# Altium schematic sheet devBoard.SchDoc: STM32 DevKit
size A3; Author: Mehran Ahmadi; DrawnBy: Mehran Ahmadi; DocumentNumber: 1; Revision: 1; SheetNumber: 1; SheetTotal: 1
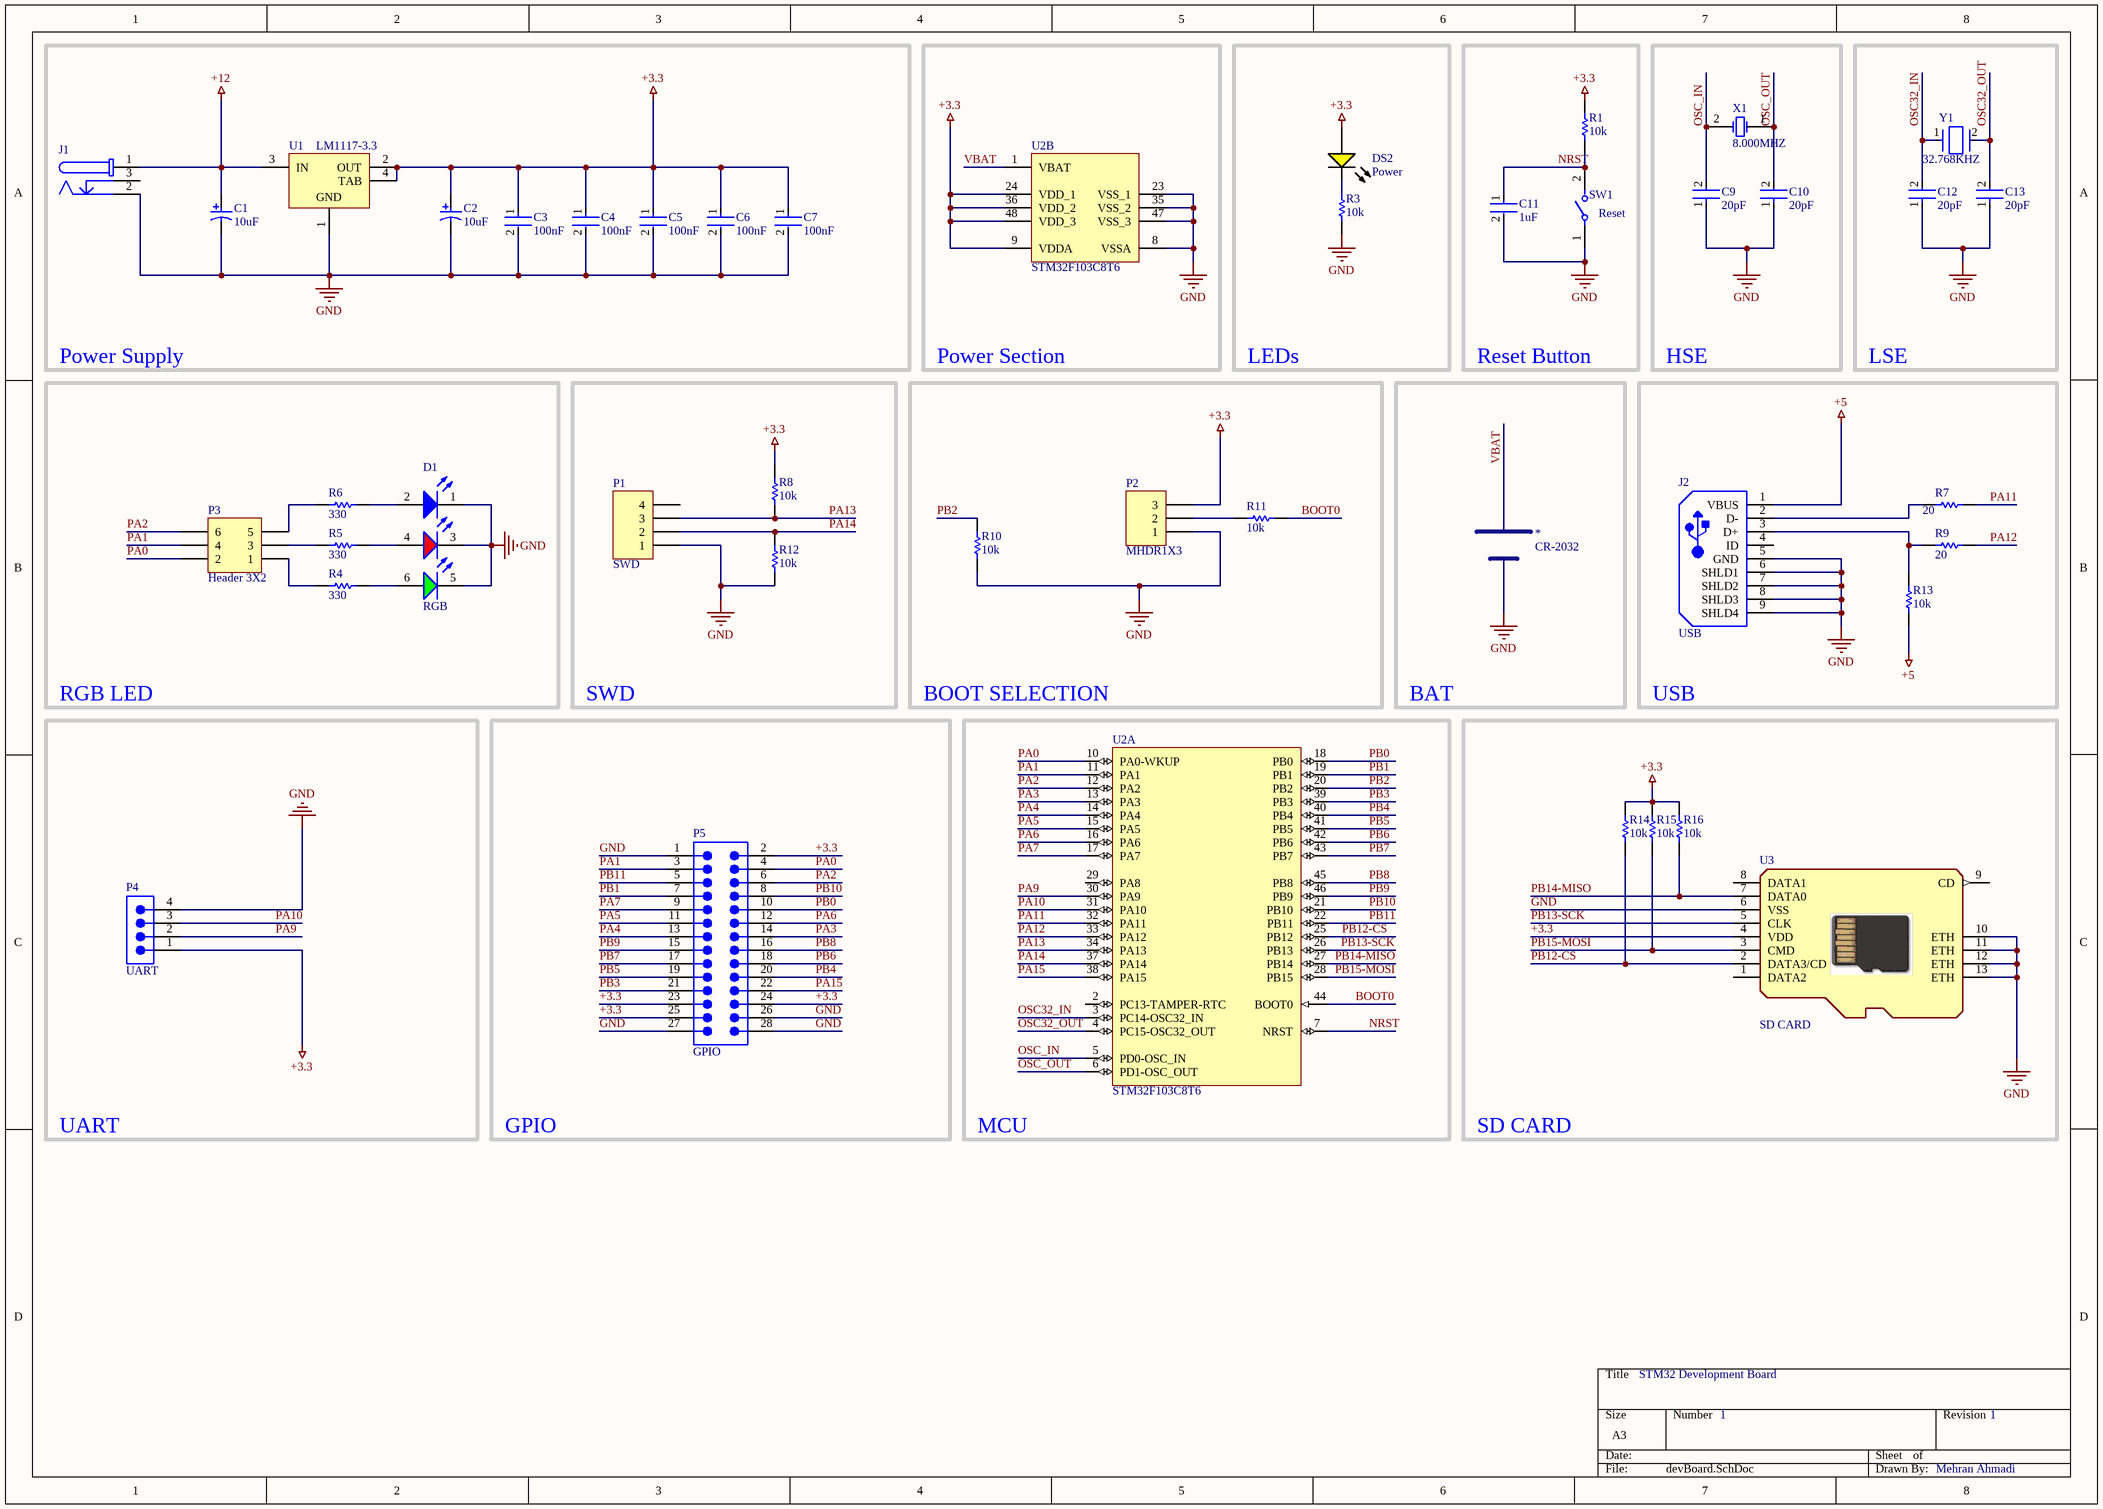
[diagram p0: devBoard.SchDoc]

## Parts
*  CR-2032  [CR-2032]
C1  10uF  [PNSC-EEE1CA100SR_L]
C2  10uF  [PNSC-EEE1CA100SR_L]
C3  100nF  [FP-1206-L_3_2_0_2-W_1_6_0-MFG]
C4  100nF  [FP-1206-L_3_2_0_2-W_1_6_0-MFG]
C5  100nF  [FP-1206-L_3_2_0_2-W_1_6_0-MFG]
C6  100nF  [FP-1206-L_3_2_0_2-W_1_6_0-MFG]
C7  100nF  [FP-1206-L_3_2_0_2-W_1_6_0-MFG]
C9  20pF  [FP-CL31-IPC_A]
C10  20pF  [FP-CL31-IPC_A]
C11  1uF  [FP-1206-L_3_2_0_2-W_1_6_0-MFG]
C12  20pF  [FP-CL31-IPC_A]
C13  20pF  [FP-CL31-IPC_A]
D1  RGB  [WL-SFTW_5050_150505M173300]
DS2  Power  [LUMX-SML-LX1206YC-TR_V]
J1  (no value)  [694106301002]
J2  USB  [MOLX-56579-0576_V]
P1  SWD  [HDR1X4]
P2  MHDR1X3  [MHDR1X3]
P3  Header 3X2  [HDR2X3]
P4  UART  [61300411121]
P5  GPIO  [61302821121]
R1  10k  [RESC3116X65X40ML10T20]
R3  10k  [RESC3116X65X40ML10T20]
R4  330  [RESC3116X65X40ML10T20]
R5  330  [RESC3116X65X40ML10T20]
R6  330  [RESC3116X65X40ML10T20]
R7  20  [RESC3116X65X40ML10T20]
R8  10k  [RESC3116X65X40ML10T20]
R9  20  [RESC3116X65X40ML10T20]
R10  10k  [RESC3116X65X40ML10T20]
R11  10k  [RESC3116X65X40ML10T20]
R12  10k  [RESC3116X65X40ML10T20]
R13  10k  [RESC3116X65X40ML10T20]
R14  10k  [RESC3116X65X40ML10T20]
R15  10k  [RESC3116X65X40ML10T20]
R16  10k  [RESC3116X65X40ML10T20]
SW1  Reset  [FP-1825965-1-MFG]
U1  LM1117-3.3  [DCY0004A_N]
U2  STM32F103C8T6  [STM-LQFP48_L]  (parts A,B of 2)
U3  SD CARD  [TFWF1-EBXX-1X0X]
X1  8.000MHZ  [ABRA-ABLS-14.7456MHZ-B2-T_V]
Y1  32.768KHZ  [FP-AB26TRB-MFG]

## Blocks framed on the sheet
Power Supply: C1-C7 J1 U1
Power Section: U2
LEDs: DS2 R3
Reset Button: C11 R1 SW1
HSE: C9 C10 X1
LSE: C12 C13 Y1
SWD: P1 R8 R12
BOOT SELECTION: P2 R10 R11
BAT: *
USB: J2 R7 R9 R13
GPIO: P5
MCU: U2
SD CARD: R14-R16 U3

## Nets
+3.3: C2.1 C3.1 C4.1 C5.1 C6.1 C7.1 DS2.1(A) P2.3 P4.1 P5.2 P5.23 P5.24 P5.25 R1.2 R8.2 R14.1 R15.1 R16.1 U1.2(OUT) U1.4(TAB) U2.9(VDDA) U2.24(VDD_1) U2.36(VDD_2) U2.48(VDD_3) U3.4(VDD)
+5: J2.1(VBUS) R13.2
+12: C1.1 J1.1 U1.3(IN)
GND: *.2 C1.2 C2.2 C3.2 C4.2 C5.2 C6.2 C7.2 C9.1 C10.1 C11.2 C12.1 C13.1 D1.1(K) D1.3(K) D1.5(K) J1.2 J2.5(GND) J2.6(SHLD1) J2.7(SHLD2) J2.8(SHLD3) J2.9(SHLD4) P1.1 P2.1 P4.4 P5.1 P5.26 P5.27 P5.28 R3.1 R10.2 R12.1 SW1.1 U1.1(GND) U2.8(VSSA) U2.23(VSS_1) U2.35(VSS_2) U2.47(VSS_3) U3.6(VSS) U3.10(ETH) U3.11(ETH) U3.12(ETH) U3.13(ETH)
BOOT0: R11.1 U2.44(BOOT0)
NRST: C11.1 R1.1 SW1.2 U2.7(NRST)
OSC32_IN: C12.2 U2.3(PC14-OSC32_IN) Y1.1
OSC32_OUT: C13.2 U2.4(PC15-OSC32_OUT) Y1.2
OSC_IN: C9.2 U2.5(PD0-OSC_IN) X1.2(X2)
OSC_OUT: C10.2 U2.6(PD1-OSC_OUT) X1.1(X1)
PA0: P3.2 P5.4 U2.10(PA0-WKUP)
PA1: P3.4 P5.3 U2.11(PA1)
PA2: P3.6 P5.6 U2.12(PA2)
PA3: P5.14 U2.13(PA3)
PA4: P5.13 U2.14(PA4)
PA5: P5.11 U2.15(PA5)
PA6: P5.12 U2.16(PA6)
PA7: P5.9 U2.17(PA7)
PA9: P4.2 U2.30(PA9)
PA10: P4.3 U2.31(PA10)
PA11: R7.2 U2.32(PA11)
PA12: R9.2 U2.33(PA12)
PA13: P1.3 R8.1 U2.34(PA13)
PA14: P1.2 R12.2 U2.37(PA14)
PA15: P5.22 U2.38(PA15)
PB0: P5.10 U2.18(PB0)
PB1: P5.7 U2.19(PB1)
PB2: R10.1 U2.20(PB2)
PB3: P5.21 U2.39(PB3)
PB4: P5.20 U2.40(PB4)
PB5: P5.19 U2.41(PB5)
PB6: P5.18 U2.42(PB6)
PB7: P5.17 U2.43(PB7)
PB8: P5.16 U2.45(PB8)
PB9: P5.15 U2.46(PB9)
PB10: P5.8 U2.21(PB10)
PB11: P5.5 U2.22(PB11)
PB12-CS: R14.2 U2.25(PB12) U3.2(DATA3/CD)
PB13-SCK: U2.26(PB13) U3.5(CLK)
PB14-MISO: R16.2 U2.27(PB14) U3.7(DATA0)
PB15-MOSI: R15.2 U2.28(PB15) U3.3(CMD)
VBAT: *.1 U2.1(VBAT)
NetD1_2: D1.2(A) R6.1
NetD1_4: D1.4(A) R5.1
NetD1_6: D1.6(A) R4.1
NetDS2_2: DS2.2(K) R3.2
NetJ2_2: J2.2(D-) R7.1
NetJ2_3: J2.3(D+) R9.1 R13.1
NetP2_2: P2.2 R11.2
NetP3_1: P3.1 R4.2
NetP3_3: P3.3 R5.2
NetP3_5: P3.5 R6.2

Not connected (* = marked no-connect by the designer): J1 3; J2 4(ID); P1 4; U2 2(PC13-TAMPER-RTC) 29(PA8); U3 1(DATA2) 8(DATA1) 9(CD)

## Notes on the sheet
- RGB LED
- UART
- STM32 Development Board
- 1
- Mehran Ahmadi
- (in symbol TFWF1-EBXX-1X0X) Card Bottom View

## Library data of the parts
C1 C2 = CMP-2000-06199-1: Aluminum Electrolytic Capacitor, 10 uF, +/- 20%, -40 to 85 degC, 2-Pin SMD, RoHS, Tape and Reel; Manufacturer: Panasonic; Lead Length: 1.8mm; No. of Pins: 2; Ripple Current Frequency: 120Hz; Ripple Current Temperature: 85°C; External Depth: 4.3mm; Operating Lifetime: 2000h; Power Factor: 0.16; Lead Cross-section Width: 0.65mm; Product Range: PANASONIC-SSeries; Voltage Rating V DC: 16V; Leakage Current: 3µA; Ripple Current AC: 28mA; AE Capacitor Case: RadialCan-SMD; Capacitance: 10µF; Lifetime @ Temperature: 2000hours@85°C; External Length / Height: 5.4mm; SVHC: NoSVHC(16-Dec-2013); Packaging: CutTape; Series: VS; Package Description: 2-Pin Surface Mount Device, Body 4.5 x 4.5 mm; Tolerance -: 20%; Capacitor Terminals: SMD; Lead Spacing: 1mm; Package / Case: B; Capacitance Tolerance: ±20%; Operating life Time: 2000h; Tape Width: 12mm; Power Factor Frequency: 120Hz; Voltage Rating: 16V; Diameter: 4mm; Operating Temperature Max: 85°C; Datasheet URL: https://datasheet.ciiva.com/19458/1355487-19458346.pdf; Capacitor Mounting: SMD; External Width: 4.3mm; Operating Life Temperature: 85°C; Capacitance Tolerance ±: ±20%; Package Reference: EEE1CA100SR; AC Ripple Current: 28mA; Tolerance +: 20%; Height: 5.4mm; Datasheet Version: 04/2005; Operating Temperature Min: -40°C; Capacitor Case Style: RadialCan-SMD; Mounting Technology: SurfaceMount; Operating Temperature Range: -40°Cto+85°C; Manufacturer URL: http://www.panasonic.com/; Life Time @ Temperature: 2000hours@85°C
C3-C7 C11 = CMP-2000-05018-2: General Purpose Ceramic Capacitor, 1206, 100nF, 10%, X7R, 15%, 50V; Dissipation Factor: 2.5%; Insulation Resistance: 100GR; Dielectric: X7R; Thickness: 0.037inch; Case Code (Imperial): 1206; Case Code (Metric): 3216; Dielectric Material: Ceramic; Width: 1.6mm; Voltage Rating (DC): 50V; Termination: SMD/SMT; Tolerance: 10%; REACH SVHC: No SVHC; Height: 0.94mm; Length: 3.2mm; Voltage: 50V; Capacitance: 100nF; Packaging: Tape and Reel; Depth: 1.6mm; Voltage Rating: 50V; Series: -; Contact Plating: Tin; Mount: Surface Mount; Package Quantity: 1; Construction: Flat; Max Operating Temperature: 125°C; Min Operating Temperature: -55°C; Case/Package: 1206; Lead Free: Lead Free; RoHS Compliant: Yes; Number of Pins: 2; Radiation Hardening: No
C9 C10 C12 C13 = CMP-13271-001087-1: Cap Ceramic 20pF 50V C0G ±5% SMD 1206 +125°C Embossed T/R; Tolerance: 5%; Voltage Rating: 50V; Packaging: Tape and Reel; Case/Package: 1206; Max Operating Temperature: 125°C; Mount: Surface Mount; Min Operating Temperature: -55°C; Thickness: 0.039inch; Width: 0.063inch; Case Code (Imperial): 1206; Length: 3.2mm; Dielectric: C0G; Radiation Hardening: No; Capacitance: 20pF; Depth: 1.6mm; Case Code (Metric): 3216; Package Quantity: 1; Height: 0.85mm
D1 = CMP-03913-90235585-1: 150505M173300 WL-SFTW SMT full-color TOP LED waterclear; Max Reverse Voltage (DC): 5V; Forward Current: 80mA; Max Junction Temperature (Tj): 115°C; Peak Wavelength: 465nm; Color: Blue, Green, Red; Viewing Angle: 120°; Luminous Intensity: 350mcd; Dominant Wavelength: 520nm; Forward Voltage: 2V; Power Dissipation: 72mW; Length: 5.4mm; Width: 5mm; Min Operating Temperature: -40°C; Height: 1.5mm; Packaging: Tape and Reel; Max Operating Temperature: 85°C; RoHS: Compliant; Reverse Voltage: 5V; NexarPartId: 90235585
DS2 = CMP-2000-07124-1: Yellow LED, Water Clear Len, 585 nm, 2.1 V, -40 to 85 degC, 2-Pin SMD, RoHS, Tape and Reel; Manufacturer: Lumex; Product Training Modules: LEDsBenefitsofCustomLEDandLCDTechnology; Millicandela Rating: 6mcd; Catalog Drawings: SML-LX1206SeriesTopSML-LX1206SeriesSideSML-LX1206SeriesBottomSML-LX1206SeriesFootprint; Wavelength - Peak: 585nm; Other Names: 67-1358-2LU60357TRSMLLX1206YCTR; Lens Style/Size: RectanglewithFlatTop; Current - Test: 20mA; Lens Color: Colorless; Viewing Angle: 160°; Voltage - Forward (Vf) (Typ): 2.1V; Online Catalog: SML-LX1206RectanglewithFlatTop1206PackageLEDs; Mounting Type: SurfaceMount; Package Description: 2-Pin Surface Mount Device, Body 3.2 x 1.5 mm; Datasheet Version: Rev. K, 08/2012; Features: -; Color: Yellow; RoHS Information: RoHSCertofCompliance; Package Reference: SML-LX1206YC-TR; Supplier Device Package: 1206; Standard Package: 3,000; Series: -; Wavelength - Dominant: -; Package / Case: 1206(3216Metric); Mounting Technology: SurfaceMount; Height (Max): 1.10mm; Lens Transparency: Clear; Datasheet URL: http://www.lumex.com/content/files/ProductAttachment/SML-LX1206YC-TR.pdf; Family: LEDIndication-Discrete; Manufacturer URL: http://www.lumexinstruments.com/; Packaging: Tape&Reel(TR); Category: Optoelectronics; Size / Dimension: 3.20mmLx1.60mmW
J1 = CMP-1502-00188-2: NexarPartId: 52676100; Voltage Rating (DC): 20V; Gender: Male; Voltage Rating: 24V; Connector Type: Power; Insulation Resistance: 100MΩ; Current Rating: 5A; Shielding: Unshielded; Number of Contacts: 3; Color: Black; Housing Material: Polyamide; Contact Gender: Female; REACH SVHC: Unknown; Termination: Through Hole; Height: 11mm; RoHS: Compliant; Mount: Through Hole; Flammability Rating: UL94 V-0; Packaging: Bulk; Min Operating Temperature: -40°C; Contact Plating: Tin; Max Operating Temperature: 85°C; Operating Supply Voltage: 24V; Contact Material: Gold, Tin
J2 = CMP-2000-05643-1: USB Connector, 30 V, 1 A, 0 to 50 degC, 5-Pin SMD, RoHS, Tape and Reel; Brand: Molex; Insulation Resistance: 100MOhms; Connector Type: MiniUSBTypeABReceptacle; Mounting Angle: Right; Number of Ports: 1Port; Gender: Female; Voltage Rating: 30VAC/DC; Number of Contacts: 5Contact; Current Rating: 1A; Package Reference: 56579-0576; Package Description: 5-Pin Surface Mount Device, Body 9.9 x 9 mm, Pitch 0.8 mm; Color: Gray; Manufacturer URL: http://www.molex.com/; Product: MiniUSBTypeABConnectors; Factory Pack Quantity: 800; Standard: USB; Termination Style: SolderTab; Contact Plating: Gold; Product Category: USBConnectors; Datasheet Version: Rev. E, 04/2006; Operating Temperature Range: 0Cto+50C; RoHS: Details; Manufacturer: Molex; Features: MetalshieldingforESDprotection; Mounting Technology: SurfaceMount; Flammability Rating: UL94V-0; Datasheet URL: http://www.molex.com/pdm_docs/sd/565790576_sd.pdf; Series: 56579; Contact Material: CopperAlloy; Packaging: Reel
P1 = Header 4: Header, 4-Pin; LatestRevisionDate: 17-Jul-2002; LatestRevisionNote: Re-released for DXP Platform.; Publisher: Altium Limited
P2 = MHDR1X3: Header, 3-Pin; LatestRevisionDate: 17-Jul-2002; LatestRevisionNote: Re-released for DXP Platform.; Publisher: Altium Limited
P3 = Header 3X2: Header, 3-Pin, Dual row; LatestRevisionDate: 17-Jul-2002; LatestRevisionNote: Re-released for DXP Platform.; Publisher: Altium Limited
P4 = CMP-1502-01064-3: NexarPartId: 32855522; Operating Supply Voltage: 250V; Pitch: 2.54mm; Contact Resistance: 20mΩ; Number of Positions: 4; Current Rating: 3A; Connector Type: Male Pin; Gender: Male; Contact Plating: Gold; Height: 8.89mm; Lead Pitch: 2.54mm; Lead Free: Lead Free; Contact Mating Length: 5.9944mm; Number of Rows: 1; Termination: Solder; Packaging: Bulk; REACH SVHC: Unknown; Min Operating Temperature: -40°C; RoHS: Compliant; Number of Contacts: 4; Voltage Rating: 250V; Color: Black; Max Operating Temperature: 105°C; Contact Material: Copper; Mount: Through Hole; Orientation: Vertical; Number of Pins: 4
P5 = CMP-1502-01115-3: NexarPartId: 32855566; Pitch: 2.54mm; Current Rating: 3A; Gender: Male; Connector Type: Male Pin; Number of Positions: 28; Contact Resistance: 20mΩ; Operating Supply Voltage: 250V; Packaging: Bulk; Number of Rows: 2; REACH SVHC: Unknown; RoHS: Compliant; Termination: Solder; Lead Pitch: 2.54mm; Contact Material: Copper; Number of Pins: 28; Row Spacing: 2.54mm; Orientation: Vertical; Contact Mating Length: 5.9944mm; Contact Plating: Gold; Color: Black; Mount: Through Hole; Number of Contacts: 28
R1 R3-R16 = CMP-1014-00623-2: Chip Resistor, 10 KOhm, +/- 1%, 0.25 W, -55 to 155 degC, 1206 (3216 Metric), RoHS, Tape and Reel; Manufacturer: Yageo; Voltage Rating: 200V; Resistance: 10KOhm; Temperature Coefficient: 100ppm/degreesC; Power Rating: 250mW; Packaging: TapeandReel; Termination: SMD/SMT; REACH SVHC: Unknown; Tolerance: 1%; Height: 0.55mm; Composition: ThickFilm; Max Operating Temperature: 155degC; Datasheet Version: Rev. 5, 10/2016; Lead Free: LeadFree; Case Code (Metric): 3216; Depth: 1.6mm; Package Quantity: 5000; RoHSCompliant: true; Military Standard: Not; Case/Package: 1206; Case Code (Imperial): 1206; Min Operating Temperature: -55degC; Datasheet URL: http://www.yageo.com/NewPortal/yageodocoutput?fileName=/pdf/R-Chip/PYu-RC_Group_51_RoHS_L_5.pdf; Length: 3.1mm; Manufacturer URL: http://www.yageo.com/; Package Reference: 1206.0; Width: 1.6mm; Package Description: 2-Pin Surface Mount Device, Body 3.1 x 1.6 mm
SW1 = CMP-03407-000024-1: SWITCH TACTILE SPST-NO 0.05A 24V; Mechanical Life: 100000Cycles; Switch Travel: 0.25mm; Contact Current Rating: 50mA; Actuator Length: 1.52mm; Operating Force: 1.3N; Switch Function: Off-Mom; Contact Resistance: 100mR; Illumination Type: Non-Illuminated; Throw Configuration: SPST; Actuator Material: PBT; Electrical Life: 20000Cycles; Series: FSM, Alcoswitch; Termination: PC Pins; Package Quantity: 1000; Lead Free: Lead Free; Packaging: Loose Piece; Max Operating Temperature: 105°C; Max Voltage Rating (DC): 24V; Max Current Rating: 50mA; Contact Plating: Silver; Length: 3.5mm; Depth: 6.5mm; RoHS Compliant: Yes; ELV: Compliant; Mount: Through Hole; Min Operating Temperature: -35°C; Contact Material: Copper Alloy; Orientation: Straight; Voltage Rating (DC): 24V; Type: Switch
U1 = CMP-0062-01631-4: 800mA Low-Dropout Linear Regulator, 4-pin SOT-223, Pb-Free; PartNumber: LM1117IMP-3.3/NOPB; Manufacturer: Texas Instruments; PackageTopMarking: XYTT*N05B; PowerWise: N; High-Reliability: Y; CompType: LDO IC; Code_IPC: SOT223-4; PackageReference: DCY0004A; PinCount: 4; PackageDescription: Molded SOT-223, 6.50 x 3.56 x 1.6mm Body, 4 Lead, 2.3mm Pitch; RoHS: Y; ComponentLink1Description: Datasheet URL; Code_JEDEC: TO-261-AA; ComponentLink1URL: http://www.ti.com/general/docs/lit/getliterature.tsp?genericPartNumber=LM1117-N&fileType=pdf
U2 = CMP-0237-00215-3: ARM Cortex-M3 32-bit MCU, 64 KB Flash, 20 KB Internal RAM, 37 I/Os, 48-pin LQFP, -40 to 85 degC, Tray; Supply Voltage(Vcc) min (V): 2; Internal RAM Size (kB): 20; FLASH Size (Prog) (kB): 64; A/D Converter: 2x12-bit (10 Channel); I/Os (High Current): 37; Operating Frequency(F) (Processor speed) (MHz): 72; Core: ARM Cortex-M3; ComponentLink3Description: Package Specification; Mounting Technology: Surface Mount; PartNumber: STM32F103C8T6; PackageReference: LQFP48; Packing: Tray; ComponentLink3URL: http://www.st.com/st-web-ui/static/active/en/resource/technical/document/datasheet/DM00058181.pdf; DatasheetVersion: Rev. 16; ComponentLink1URL: http://www.st.com/web/en/home.html; PackageVersion: Rev. 6, 06/2013; ComponentLink2URL: http://www.st.com/st-web-ui/static/active/en/resource/technical/document/datasheet/CD00161566.pdf; ComponentLink1Description: Manufacturer URL; ComponentLink2Description: Datasheet; PackageDescription: 48-Pin Low Profile Quad Flat Package, 7 x 7 mm Body, 0.5 mm Pitch
U3 = TFWF1-EBXX-1X0X: T-Flash 8pin SMT; Manufacturer: Wellco T&C Co., Ltd.; Link to Datasheet: *; Link to Picture: *; Operating Temp: *; Rating: *; Stability Frequency: *; Storage Temp: *; Tolerance: *; ComponentLink1Description: *; ComponentLink1URL: *; Manufacture Part #: TFWF1-EBXX-1X0X; Value: SD CARD
X1 = CMP-2000-05726-1: Low Profile Crystal, 8.0 MHz, +/- 30 ppm, -20 to 70 degC, 2-Pin SMD, RoHS, Tape and Reel; Brand: ABRACON; Case Length: 11.4mm; Frequency Stability: 50PPM; ESR: 80Ohms; Case Height: 4.2mm; Tolerance: 30PPM; Frequency: 8MHz; Case Width: 4.7mm; Load Capacitance: 18pF; Datasheet Version: 04/2011; Termination Style: SMD/SMT; Dimensions: 4.7mmWx11.4mmLx4.2mmH; Packaging: Reel; Manufacturer: ABRACON; Package URL: http://www.abracon.com/Support/PackageDrawing/Resonators/ABLS-2D.pdf; Mounting Technology: SurfaceMount; Package Reference: ABLS-14.7456MHZ-B2-T; Product Category: Crystals; Package Description: 2-Pin Surface Mount Device, Body 11.4 x 4.7 mm; Package / Case: HC-49/US; Mounting Style: SMD/SMT; Operating Temperature Range: -20Cto+70C; Series: ABLS; Factory Pack Quantity: 1000; Datasheet URL: http://www.abracon.com/Resonators/abls.pdf; Manufacturer URL: http://www.abracon.com/; RoHS: Details; Type: LowProfileMicroprocessorCrystal
Y1 = CMP-27762-006068-1: CRYSTAL 32.7680KHZ 12.5PF TH; Frequency Stability: -0.034ppm; Frequency Tolerance: 20ppm; Series Resistance: 50kR; Case/Package: Radial; Package Quantity: 500; Packaging: Tape and Reel; Lead Pitch: 2.54mm; Termination: Radial; Mount: Surface Mount; Frequency: 32.768kHz; Min Operating Temperature: -40°C; REACH SVHC: No SVHC; Load Capacitance: 12.5pF; Lead Free: Lead Free; Operating Frequency: 32.768 kHz; Max Operating Temperature: 85°C; Length: 6mm; Height: 0.075inch; Depth: 1.9mm; Tolerance: 20ppm; ESR (Equivalent Series Resistance): 50kR; Number of Pins: 2; Series: AB26TRB